# EAGLE design RasPi-BplusHAT (EAGLE 7.3.0)
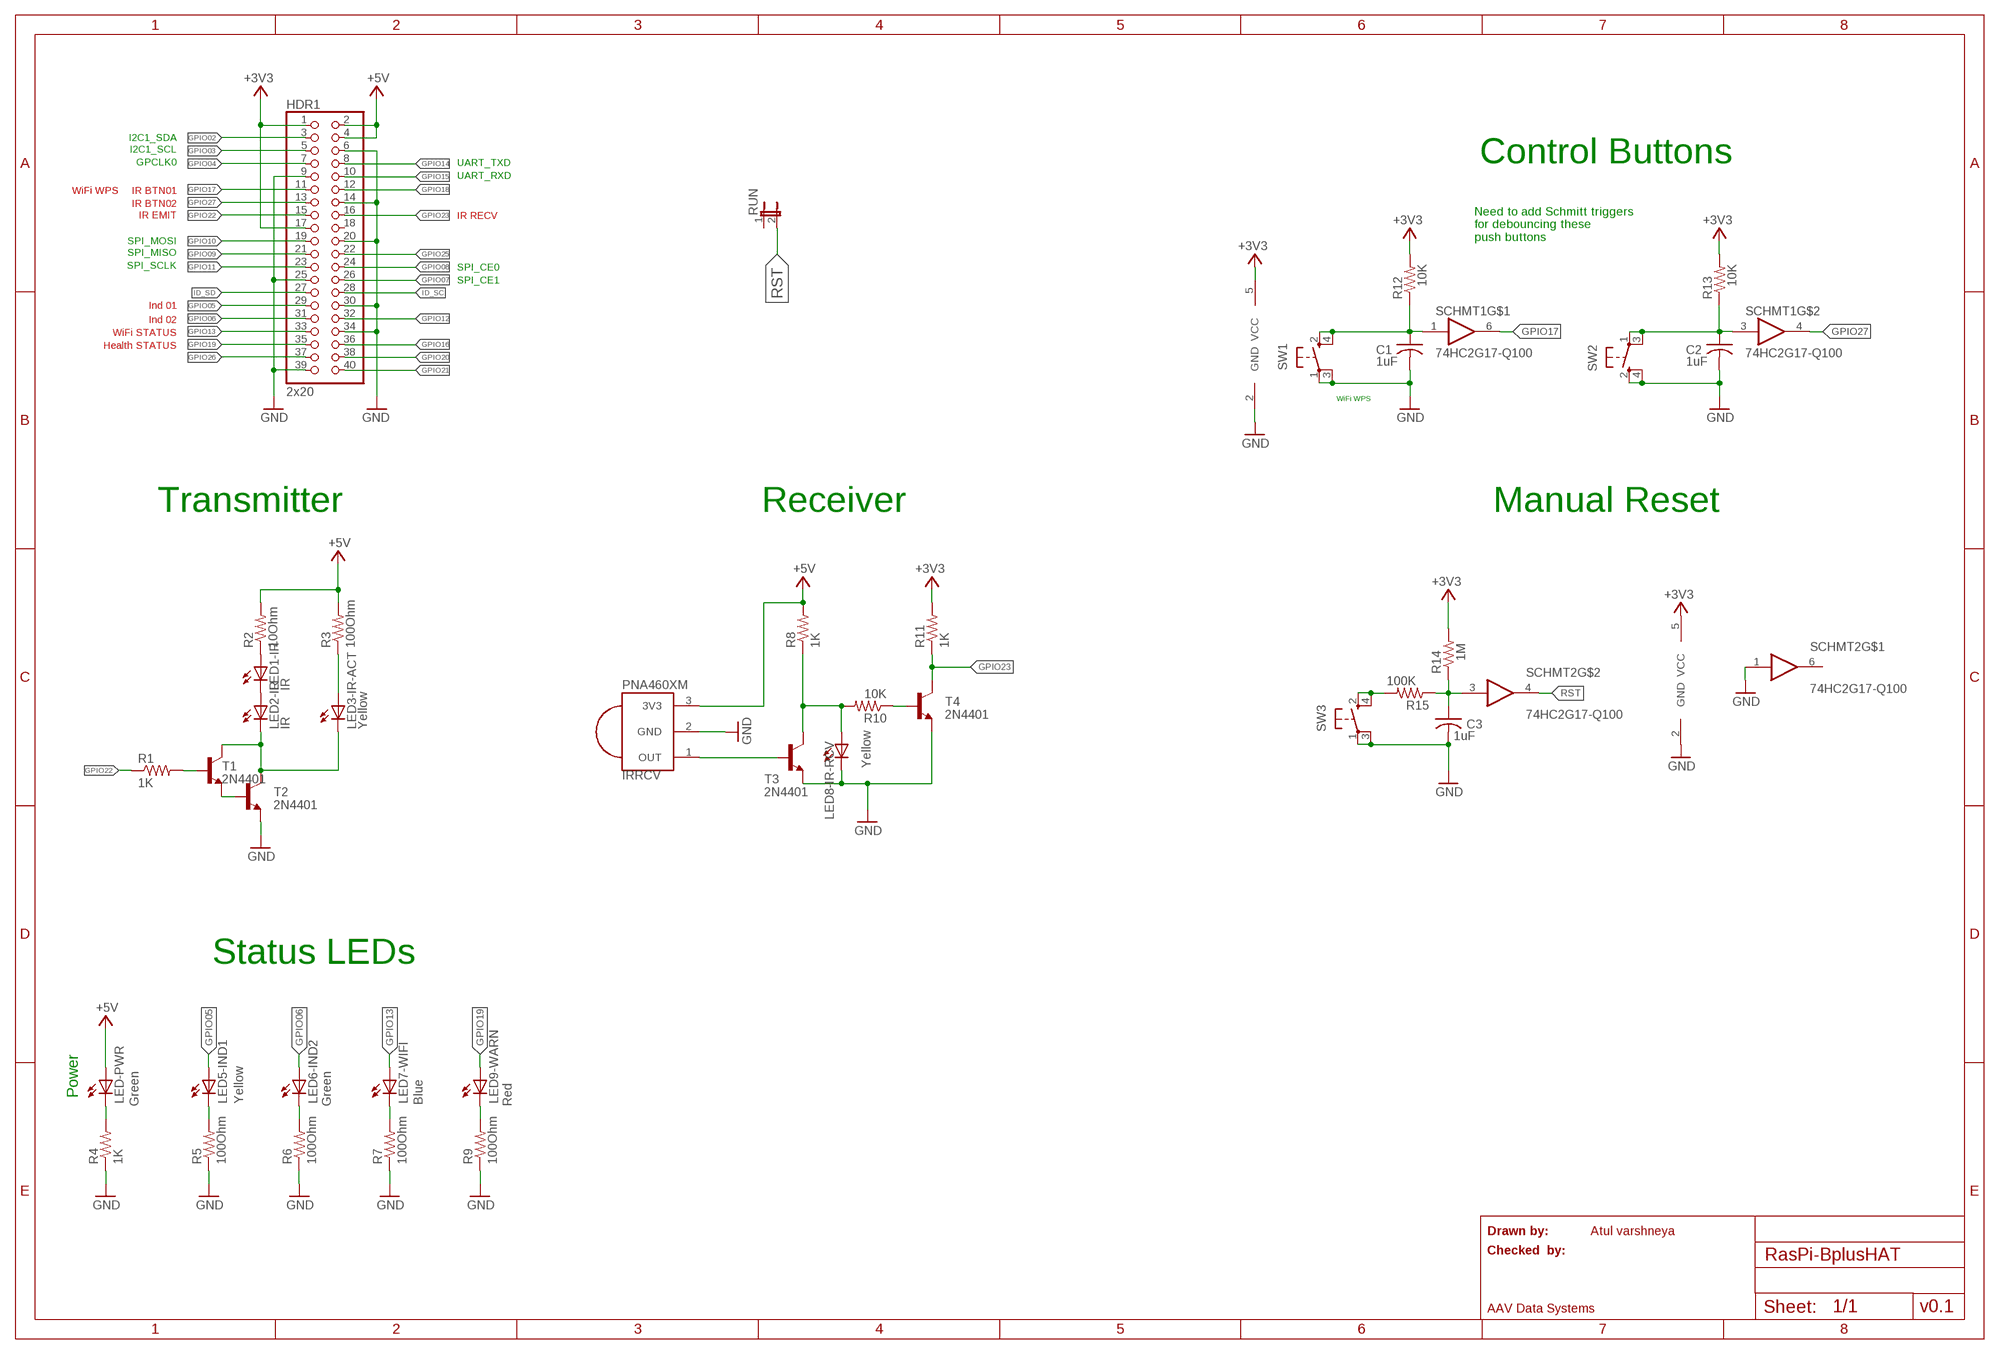
[diagram p0: schematic, sheet 1]

## Parts
C1  1uF  C-USC0805  [C0805]
C2  1uF  C-USC0805  [C0805]
C3  1uF  C-USC0805  [C0805]
HDR1  2x20  PINHD-2X20  [2X20]
IRRCV  PNA460XM  [PNA460XM]
LED1-IR  IR  LEDMICRO-SIDELED  [MICRO-SIDELED]
LED2-IR  IR  LEDMICRO-SIDELED  [MICRO-SIDELED]
LED3-IR-ACT  Yellow  LEDCHIPLED_0805  [CHIPLED_0805]
LED5-IND1  Yellow  LEDCHIPLED_0805  [CHIPLED_0805]
LED6-IND2  Green  LEDCHIPLED_0805  [CHIPLED_0805]
LED7-WIFI  Blue  LEDCHIPLED_0805  [CHIPLED_0805]
LED8-IR-RCV  Yellow  LEDCHIPLED_0805  [CHIPLED_0805]
LED9-WARN  Red  LEDCHIPLED_0805  [CHIPLED_0805]
LED-PWR  Green  LEDCHIPLED_0805  [CHIPLED_0805]
R1  1K  R-US_R0805  [R0805]
R2  10Ohm  R-US_R0805  [R0805]
R3  100Ohm  R-US_R0805  [R0805]
R4  1K  R-US_R0805  [R0805]
R5  100Ohm  R-US_R0805  [R0805]
R6  100Ohm  R-US_R0805  [R0805]
R7  100Ohm  R-US_R0805  [R0805]
R8  1K  R-US_R0805  [R0805]
R9  100Ohm  R-US_R0805  [R0805]
R10  10K  R-US_R0805  [R0805]
R11  1K  R-US_R0805  [R0805]
R12  10K  R-US_R0805  [R0805]
R13  10K  R-US_R0805  [R0805]
R14  1M  R-US_R0805  [R0805]
R15  100K  R-US_R0805  [R0805]
RUN  RST  JP1E  [JP1]
SCHMT1  74HC2G17-Q100  [SC-70-6L]
SCHMT2  74HC2G17-Q100  [SC-70-6L]
SW1  SPST_TACT-KMR2  [KMR2]
SW2  SPST_TACT-KMR2  [KMR2]
SW3  SPST_TACT-KMR2  [KMR2]
T1  2N4401  MMBT4401LT1-NPN-SOT23-BEC  [SOT23-BEC]
T2  2N4401  MMBT4401LT1-NPN-SOT23-BEC  [SOT23-BEC]
T3  2N4401  MMBT4401LT1-NPN-SOT23-BEC  [SOT23-BEC]
T4  2N4401  MMBT4401LT1-NPN-SOT23-BEC  [SOT23-BEC]

## Nets
+3V3: HDR1.1 HDR1.17 R11.2 R12.2 R13.2 R14.2 SCHMT1.5(VCC) SCHMT2.5(VCC)
+5V: HDR1.2 HDR1.4 IRRCV.3(3V3) LED-PWR.A R2.2 R3.2 R8.2
GND: C1.2 C2.2 C3.2 HDR1.6 HDR1.9 HDR1.14 HDR1.20 HDR1.25 HDR1.30 HDR1.34 HDR1.39 IRRCV.2(GND) LED8-IR-RCV.C R4.1 R5.1 R6.1 R7.1 R9.1 SCHMT1.2(GND) SCHMT2.1(I) SCHMT2.2(GND) SW1.1(P) SW1.3(P1) SW2.2(S) SW2.4(S1) SW3.1(P) SW3.3(P1) T2.E T3.E T4.E
GPIO02: HDR1.3
GPIO03: HDR1.5
GPIO04: HDR1.7
GPIO05: HDR1.29 LED5-IND1.A
GPIO06: HDR1.31 LED6-IND2.A
GPIO07: HDR1.26
GPIO08: HDR1.24
GPIO09: HDR1.21
GPIO10: HDR1.19
GPIO11: HDR1.23
GPIO12: HDR1.32
GPIO13: HDR1.33 LED7-WIFI.A
GPIO14: HDR1.8
GPIO15: HDR1.10
GPIO16: HDR1.36
GPIO17: HDR1.11 SCHMT1.6(O)
GPIO18: HDR1.12
GPIO19: HDR1.35 LED9-WARN.A
GPIO20: HDR1.38
GPIO21: HDR1.40
GPIO22: HDR1.15 R1.1
GPIO23: HDR1.16 R11.1 T4.C
GPIO25: HDR1.22
GPIO26: HDR1.37
GPIO27: HDR1.13 SCHMT1.4(O)
ID_SC: HDR1.28
ID_SD: HDR1.27
N$1: R15.2 SW3.2(S) SW3.4(S1)
N$2: LED1-IR.A R2.1
N$3: LED1-IR.C LED2-IR.A
N$4: LED2-IR.C LED3-IR-ACT.C T1.C T2.C
N$5: R1.2 T1.B
N$6: LED3-IR-ACT.A R3.1
N$7: LED5-IND1.C R5.2
N$8: IRRCV.1(OUT) T3.B
N$9: C1.1 R12.1 SCHMT1.1(I) SW1.2(S) SW1.4(S1)
N$10: LED8-IR-RCV.A R8.1 R10.2 T3.C
N$11: T1.E T2.B
N$12: C2.1 R13.1 SCHMT1.3(I) SW2.1(P) SW2.3(P1)
N$13: C3.1 R14.1 R15.1 SCHMT2.3(I)
N$14: LED7-WIFI.C R7.2
N$16: LED9-WARN.C R9.2
N$17: LED6-IND2.C R6.2
N$21: LED-PWR.C R4.2
N$23: R10.1 T4.B
RST: RUN.2 SCHMT2.4(O)
Unconnected: HDR1.18 RUN.1 SCHMT2.6(O)

## Notes on the sheet
- I2C1_SDA
- Control Buttons
- I2C1_SCL
- GPCLK0
- UART_TXD
- UART_RXD
- WiFi WPS | IR BTN01
- IR BTN02
- IR EMIT
- IR RECV
- SPI_MOSI
- Need to add Schmitt triggers 
  for debouncing these 
  push buttons
- SPI_MISO
- SPI_SCLK
- SPI_CE0
- SPI_CE1
- Ind 01
- Ind 02
- WiFi STATUS
- Health STATUS
- WiFi WPS
- Receiver | Manual Reset
- Transmitter
- Status LEDs
- Power
- Drawn by: | Atul varshneya
- Checked  by:
- AAV Data Systems | v0.1

## Library data of the parts
C1-C3 = adafruit:C-US: CAPACITOR, American symbol; MPN: MC0805B104K160CT; OC_NEWARK: 06R3738
HDR1 = adafruit:PINHD-2X20: PIN HEADER; OC_NEWARK: unknown
IRRCV = adafruit:PNA460XM: IR 38KHz receiver PNA4602 and related receivers http://www.ladyada.net/library/pcb/eaglelibrary.html; MPN: TSOP38238; OC_NEWARK: 02P9885
LED1-IR LED2-IR = led:LED: LED OSRAM: - CHIPLED LG R971, LG N971, LY N971, LG Q971, LY Q971, LO R971, LY R971 LH N974, LH R974 LS Q976, LO Q976, LY Q976 LO Q996 - Hyper CHIPLED LW Q18S LB Q993, LB Q99A, LB R99A - SideLED LS A670, LO A670, LY A670, LG A670, LP A670 LB A673, LV A673, LT A673, LW A673 LH A674 LY A675 LS A676, LA A676, LO A676, LY A676, LW A676 LS A679, LY A679, LG A679 - Hyper Micro SIDELED® LS Y876, LA Y876, LO Y876, LY Y876 LT Y87S - SmartLED LW L88C, LW L88S LB L89C, LB L89S, LG L890 LS L89K, LO L89K, LY L89K LS L896, LA L896, LO L896, LY L896 - TOPLED LS T670, LO T670, LY T670, LG T670, LP T670 LSG T670, LSP T670, LSY T670, LOP T670, LYG T670 LG T671, LOG T671, LSG T671 LB T673, LV T673, LT T673, LW T673 LH T674 LS T676, LA T676, LO T676, LY T676, LB T676, LH T676, LSB T676, LW T676 LB T67C, LV T67C, LT T67C, LS T67K, LO T67K, LY T67K, LW E67C LS E67B, LA E67B, LO E67B, LY E67B, LB E67C, LV E67C, LT E67C LW T67C LS T679, LY T679, LG T679 LS T770, LO T770, LY T770, LG T770, LP T770 LB T773, LV T773, LT T773, LW T773 LH T774 LS E675, LA E675, LY E675, LS T675 LS T776, LA T776, LO T776, LY T776, LB T776 LHGB T686 LT T68C, LB T68C - Hyper Mini TOPLED® LB M676 - Mini TOPLED Santana® LG M470 LS M47K, LO M47K, LY M47K Source: http://www.osram.convergy.de LUXEON: - LUMILED® LXK2-PW12-R00, LXK2-PW12-S00, LXK2-PW14-U00, LXK2-PW14-V00 LXK2-PM12-R00, LXK2-PM12-S00, LXK2-PM14-U00 LXK2-PE12-Q00, LXK2-PE12-R00, LXK2-PE12-S00, LXK2-PE14-T00, LXK2-PE14-U00 LXK2-PB12-K00, LXK2-PB12-L00, LXK2-PB12-M00, LXK2-PB14-N00, LXK2-PB14-P00, LXK2-PB14-Q00 LXK2-PR12-L00, LXK2-PR12-M00, LXK2-PR14-Q00, LXK2-PR14-R00 LXK2-PD12-Q00, LXK2-PD12-R00, LXK2-PD12-S00 LXK2-PH12-R00, LXK2-PH12-S00 LXK2-PL12-P00, LXK2-PL12-Q00, LXK2-PL12-R00 Source: www.luxeon.com KINGBRIGHT: KA-3528ASYC Source: www.kingbright.com; MPN: VSMB2943SLX01; OC_NEWARK: 62W1340
LED3-IR-ACT LED5-IND1 LED8-IR-RCV = led:LED: LED OSRAM: - CHIPLED LG R971, LG N971, LY N971, LG Q971, LY Q971, LO R971, LY R971 LH N974, LH R974 LS Q976, LO Q976, LY Q976 LO Q996 - Hyper CHIPLED LW Q18S LB Q993, LB Q99A, LB R99A - SideLED LS A670, LO A670, LY A670, LG A670, LP A670 LB A673, LV A673, LT A673, LW A673 LH A674 LY A675 LS A676, LA A676, LO A676, LY A676, LW A676 LS A679, LY A679, LG A679 - Hyper Micro SIDELED® LS Y876, LA Y876, LO Y876, LY Y876 LT Y87S - SmartLED LW L88C, LW L88S LB L89C, LB L89S, LG L890 LS L89K, LO L89K, LY L89K LS L896, LA L896, LO L896, LY L896 - TOPLED LS T670, LO T670, LY T670, LG T670, LP T670 LSG T670, LSP T670, LSY T670, LOP T670, LYG T670 LG T671, LOG T671, LSG T671 LB T673, LV T673, LT T673, LW T673 LH T674 LS T676, LA T676, LO T676, LY T676, LB T676, LH T676, LSB T676, LW T676 LB T67C, LV T67C, LT T67C, LS T67K, LO T67K, LY T67K, LW E67C LS E67B, LA E67B, LO E67B, LY E67B, LB E67C, LV E67C, LT E67C LW T67C LS T679, LY T679, LG T679 LS T770, LO T770, LY T770, LG T770, LP T770 LB T773, LV T773, LT T773, LW T773 LH T774 LS E675, LA E675, LY E675, LS T675 LS T776, LA T776, LO T776, LY T776, LB T776 LHGB T686 LT T68C, LB T68C - Hyper Mini TOPLED® LB M676 - Mini TOPLED Santana® LG M470 LS M47K, LO M47K, LY M47K Source: http://www.osram.convergy.de LUXEON: - LUMILED® LXK2-PW12-R00, LXK2-PW12-S00, LXK2-PW14-U00, LXK2-PW14-V00 LXK2-PM12-R00, LXK2-PM12-S00, LXK2-PM14-U00 LXK2-PE12-Q00, LXK2-PE12-R00, LXK2-PE12-S00, LXK2-PE14-T00, LXK2-PE14-U00 LXK2-PB12-K00, LXK2-PB12-L00, LXK2-PB12-M00, LXK2-PB14-N00, LXK2-PB14-P00, LXK2-PB14-Q00 LXK2-PR12-L00, LXK2-PR12-M00, LXK2-PR14-Q00, LXK2-PR14-R00 LXK2-PD12-Q00, LXK2-PD12-R00, LXK2-PD12-S00 LXK2-PH12-R00, LXK2-PH12-S00 LXK2-PL12-P00, LXK2-PL12-Q00, LXK2-PL12-R00 Source: www.luxeon.com KINGBRIGHT: KA-3528ASYC Source: www.kingbright.com; MPN: 150080YS75000; OC_NEWARK: 95W3804
LED6-IND2 LED-PWR = led:LED: LED OSRAM: - CHIPLED LG R971, LG N971, LY N971, LG Q971, LY Q971, LO R971, LY R971 LH N974, LH R974 LS Q976, LO Q976, LY Q976 LO Q996 - Hyper CHIPLED LW Q18S LB Q993, LB Q99A, LB R99A - SideLED LS A670, LO A670, LY A670, LG A670, LP A670 LB A673, LV A673, LT A673, LW A673 LH A674 LY A675 LS A676, LA A676, LO A676, LY A676, LW A676 LS A679, LY A679, LG A679 - Hyper Micro SIDELED® LS Y876, LA Y876, LO Y876, LY Y876 LT Y87S - SmartLED LW L88C, LW L88S LB L89C, LB L89S, LG L890 LS L89K, LO L89K, LY L89K LS L896, LA L896, LO L896, LY L896 - TOPLED LS T670, LO T670, LY T670, LG T670, LP T670 LSG T670, LSP T670, LSY T670, LOP T670, LYG T670 LG T671, LOG T671, LSG T671 LB T673, LV T673, LT T673, LW T673 LH T674 LS T676, LA T676, LO T676, LY T676, LB T676, LH T676, LSB T676, LW T676 LB T67C, LV T67C, LT T67C, LS T67K, LO T67K, LY T67K, LW E67C LS E67B, LA E67B, LO E67B, LY E67B, LB E67C, LV E67C, LT E67C LW T67C LS T679, LY T679, LG T679 LS T770, LO T770, LY T770, LG T770, LP T770 LB T773, LV T773, LT T773, LW T773 LH T774 LS E675, LA E675, LY E675, LS T675 LS T776, LA T776, LO T776, LY T776, LB T776 LHGB T686 LT T68C, LB T68C - Hyper Mini TOPLED® LB M676 - Mini TOPLED Santana® LG M470 LS M47K, LO M47K, LY M47K Source: http://www.osram.convergy.de LUXEON: - LUMILED® LXK2-PW12-R00, LXK2-PW12-S00, LXK2-PW14-U00, LXK2-PW14-V00 LXK2-PM12-R00, LXK2-PM12-S00, LXK2-PM14-U00 LXK2-PE12-Q00, LXK2-PE12-R00, LXK2-PE12-S00, LXK2-PE14-T00, LXK2-PE14-U00 LXK2-PB12-K00, LXK2-PB12-L00, LXK2-PB12-M00, LXK2-PB14-N00, LXK2-PB14-P00, LXK2-PB14-Q00 LXK2-PR12-L00, LXK2-PR12-M00, LXK2-PR14-Q00, LXK2-PR14-R00 LXK2-PD12-Q00, LXK2-PD12-R00, LXK2-PD12-S00 LXK2-PH12-R00, LXK2-PH12-S00 LXK2-PL12-P00, LXK2-PL12-Q00, LXK2-PL12-R00 Source: www.luxeon.com KINGBRIGHT: KA-3528ASYC Source: www.kingbright.com; MPN: 150080GS75000; OC_NEWARK: 95W3800
LED7-WIFI = led:LED: LED OSRAM: - CHIPLED LG R971, LG N971, LY N971, LG Q971, LY Q971, LO R971, LY R971 LH N974, LH R974 LS Q976, LO Q976, LY Q976 LO Q996 - Hyper CHIPLED LW Q18S LB Q993, LB Q99A, LB R99A - SideLED LS A670, LO A670, LY A670, LG A670, LP A670 LB A673, LV A673, LT A673, LW A673 LH A674 LY A675 LS A676, LA A676, LO A676, LY A676, LW A676 LS A679, LY A679, LG A679 - Hyper Micro SIDELED® LS Y876, LA Y876, LO Y876, LY Y876 LT Y87S - SmartLED LW L88C, LW L88S LB L89C, LB L89S, LG L890 LS L89K, LO L89K, LY L89K LS L896, LA L896, LO L896, LY L896 - TOPLED LS T670, LO T670, LY T670, LG T670, LP T670 LSG T670, LSP T670, LSY T670, LOP T670, LYG T670 LG T671, LOG T671, LSG T671 LB T673, LV T673, LT T673, LW T673 LH T674 LS T676, LA T676, LO T676, LY T676, LB T676, LH T676, LSB T676, LW T676 LB T67C, LV T67C, LT T67C, LS T67K, LO T67K, LY T67K, LW E67C LS E67B, LA E67B, LO E67B, LY E67B, LB E67C, LV E67C, LT E67C LW T67C LS T679, LY T679, LG T679 LS T770, LO T770, LY T770, LG T770, LP T770 LB T773, LV T773, LT T773, LW T773 LH T774 LS E675, LA E675, LY E675, LS T675 LS T776, LA T776, LO T776, LY T776, LB T776 LHGB T686 LT T68C, LB T68C - Hyper Mini TOPLED® LB M676 - Mini TOPLED Santana® LG M470 LS M47K, LO M47K, LY M47K Source: http://www.osram.convergy.de LUXEON: - LUMILED® LXK2-PW12-R00, LXK2-PW12-S00, LXK2-PW14-U00, LXK2-PW14-V00 LXK2-PM12-R00, LXK2-PM12-S00, LXK2-PM14-U00 LXK2-PE12-Q00, LXK2-PE12-R00, LXK2-PE12-S00, LXK2-PE14-T00, LXK2-PE14-U00 LXK2-PB12-K00, LXK2-PB12-L00, LXK2-PB12-M00, LXK2-PB14-N00, LXK2-PB14-P00, LXK2-PB14-Q00 LXK2-PR12-L00, LXK2-PR12-M00, LXK2-PR14-Q00, LXK2-PR14-R00 LXK2-PD12-Q00, LXK2-PD12-R00, LXK2-PD12-S00 LXK2-PH12-R00, LXK2-PH12-S00 LXK2-PL12-P00, LXK2-PL12-Q00, LXK2-PL12-R00 Source: www.luxeon.com KINGBRIGHT: KA-3528ASYC Source: www.kingbright.com; MPN: 150080BS75000; OC_NEWARK: 95W3799
LED9-WARN = led:LED: LED OSRAM: - CHIPLED LG R971, LG N971, LY N971, LG Q971, LY Q971, LO R971, LY R971 LH N974, LH R974 LS Q976, LO Q976, LY Q976 LO Q996 - Hyper CHIPLED LW Q18S LB Q993, LB Q99A, LB R99A - SideLED LS A670, LO A670, LY A670, LG A670, LP A670 LB A673, LV A673, LT A673, LW A673 LH A674 LY A675 LS A676, LA A676, LO A676, LY A676, LW A676 LS A679, LY A679, LG A679 - Hyper Micro SIDELED® LS Y876, LA Y876, LO Y876, LY Y876 LT Y87S - SmartLED LW L88C, LW L88S LB L89C, LB L89S, LG L890 LS L89K, LO L89K, LY L89K LS L896, LA L896, LO L896, LY L896 - TOPLED LS T670, LO T670, LY T670, LG T670, LP T670 LSG T670, LSP T670, LSY T670, LOP T670, LYG T670 LG T671, LOG T671, LSG T671 LB T673, LV T673, LT T673, LW T673 LH T674 LS T676, LA T676, LO T676, LY T676, LB T676, LH T676, LSB T676, LW T676 LB T67C, LV T67C, LT T67C, LS T67K, LO T67K, LY T67K, LW E67C LS E67B, LA E67B, LO E67B, LY E67B, LB E67C, LV E67C, LT E67C LW T67C LS T679, LY T679, LG T679 LS T770, LO T770, LY T770, LG T770, LP T770 LB T773, LV T773, LT T773, LW T773 LH T774 LS E675, LA E675, LY E675, LS T675 LS T776, LA T776, LO T776, LY T776, LB T776 LHGB T686 LT T68C, LB T68C - Hyper Mini TOPLED® LB M676 - Mini TOPLED Santana® LG M470 LS M47K, LO M47K, LY M47K Source: http://www.osram.convergy.de LUXEON: - LUMILED® LXK2-PW12-R00, LXK2-PW12-S00, LXK2-PW14-U00, LXK2-PW14-V00 LXK2-PM12-R00, LXK2-PM12-S00, LXK2-PM14-U00 LXK2-PE12-Q00, LXK2-PE12-R00, LXK2-PE12-S00, LXK2-PE14-T00, LXK2-PE14-U00 LXK2-PB12-K00, LXK2-PB12-L00, LXK2-PB12-M00, LXK2-PB14-N00, LXK2-PB14-P00, LXK2-PB14-Q00 LXK2-PR12-L00, LXK2-PR12-M00, LXK2-PR14-Q00, LXK2-PR14-R00 LXK2-PD12-Q00, LXK2-PD12-R00, LXK2-PD12-S00 LXK2-PH12-R00, LXK2-PH12-S00 LXK2-PL12-P00, LXK2-PL12-Q00, LXK2-PL12-R00 Source: www.luxeon.com KINGBRIGHT: KA-3528ASYC Source: www.kingbright.com; MPN: 150080RS75000; OC_NEWARK: 95W3801
R1 R4 R8 R11 = adafruit:R-US_: RESISTOR, American symbol; MF: VISHAY/DALE; MPN: CRCW08051K00FKEA; OC_NEWARK: 52K9723
R2 = adafruit:R-US_: RESISTOR, American symbol; MF: VISHAY/DALE; MPN: CRCW080510R0FKEA; OC_NEWARK: 52K9804
R3 R5-R7 R9 = adafruit:R-US_: RESISTOR, American symbol; MF: VISHAY/DALE; MPN: CRCW0805100RFKEA; OC_NEWARK: 52K9809
R10 R12 R13 = adafruit:R-US_: RESISTOR, American symbol; MF: VISHAY/DALE; MPN: CRCW080510K0FKEA; OC_NEWARK: 52K9795
R14 = adafruit:R-US_: RESISTOR, American symbol; MF: VISHAY/DALE; MPN: CRCW08051M00FKEA; OC_NEWARK: 52K9759
R15 = adafruit:R-US_: RESISTOR, American symbol; MF: VISHAY/DALE; MPN: CRCW0805100KFKEA; OC_NEWARK: 52K9808
RUN = jumper:JP1E: JUMPER; MPN: 2211S-02G; OC_NEWARK: 08N6744
SCHMT1 SCHMT2 = varshneya:74HC2G17-Q100: Dual schmitt non-inverting buffer; MPN: 74HC2G17GW,125; OC_NEWARK: 71R2196
SW1-SW3 = adafruit:SPST_TACT: SMT 6mm switch, EVQQ2 series http://www.ladyada.net/library/eagle; OC_NEWARK: unknown
T1 T2 = transistor-neu-to92:*-NPN-: NPN Transistror BF959 corrected 2008.03.06; MPN: MMBT4401-TP; OC_NEWARK: 51T4931
T3 T4 = transistor:*-NPN-: NPN Transistror BF959 corrected 2008.03.06; MPN: MMBT4401-TP; OC_NEWARK: 51T4931

## Board
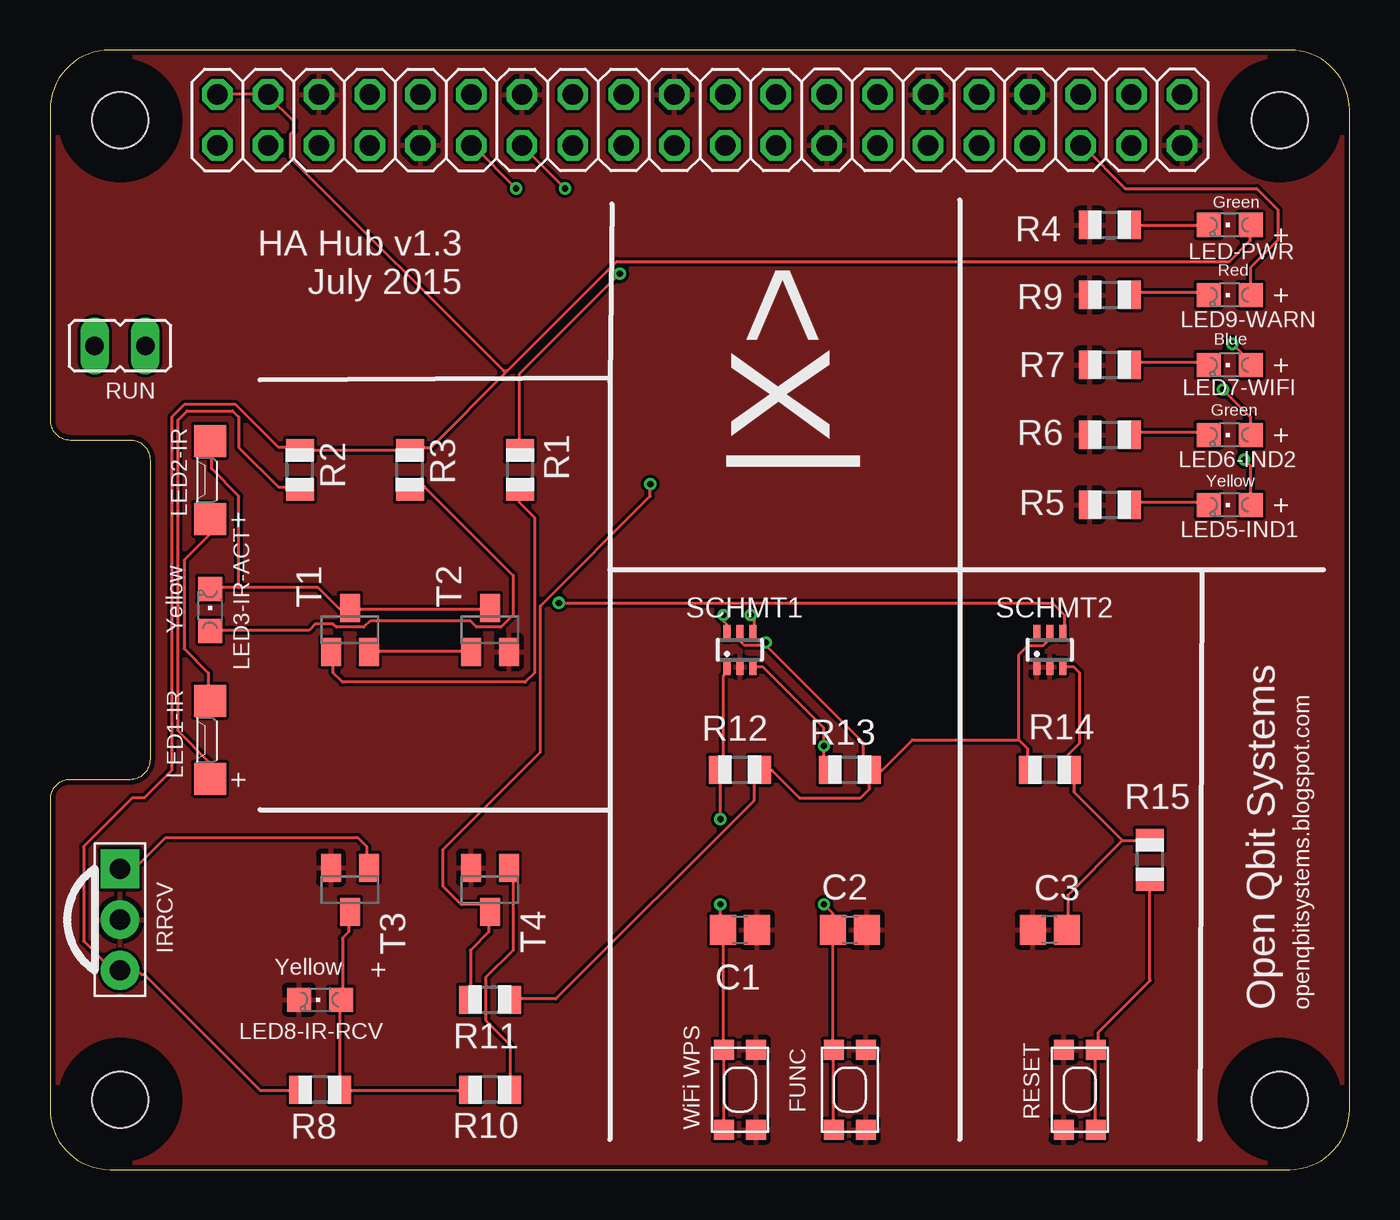
[diagram p1: board, top side]
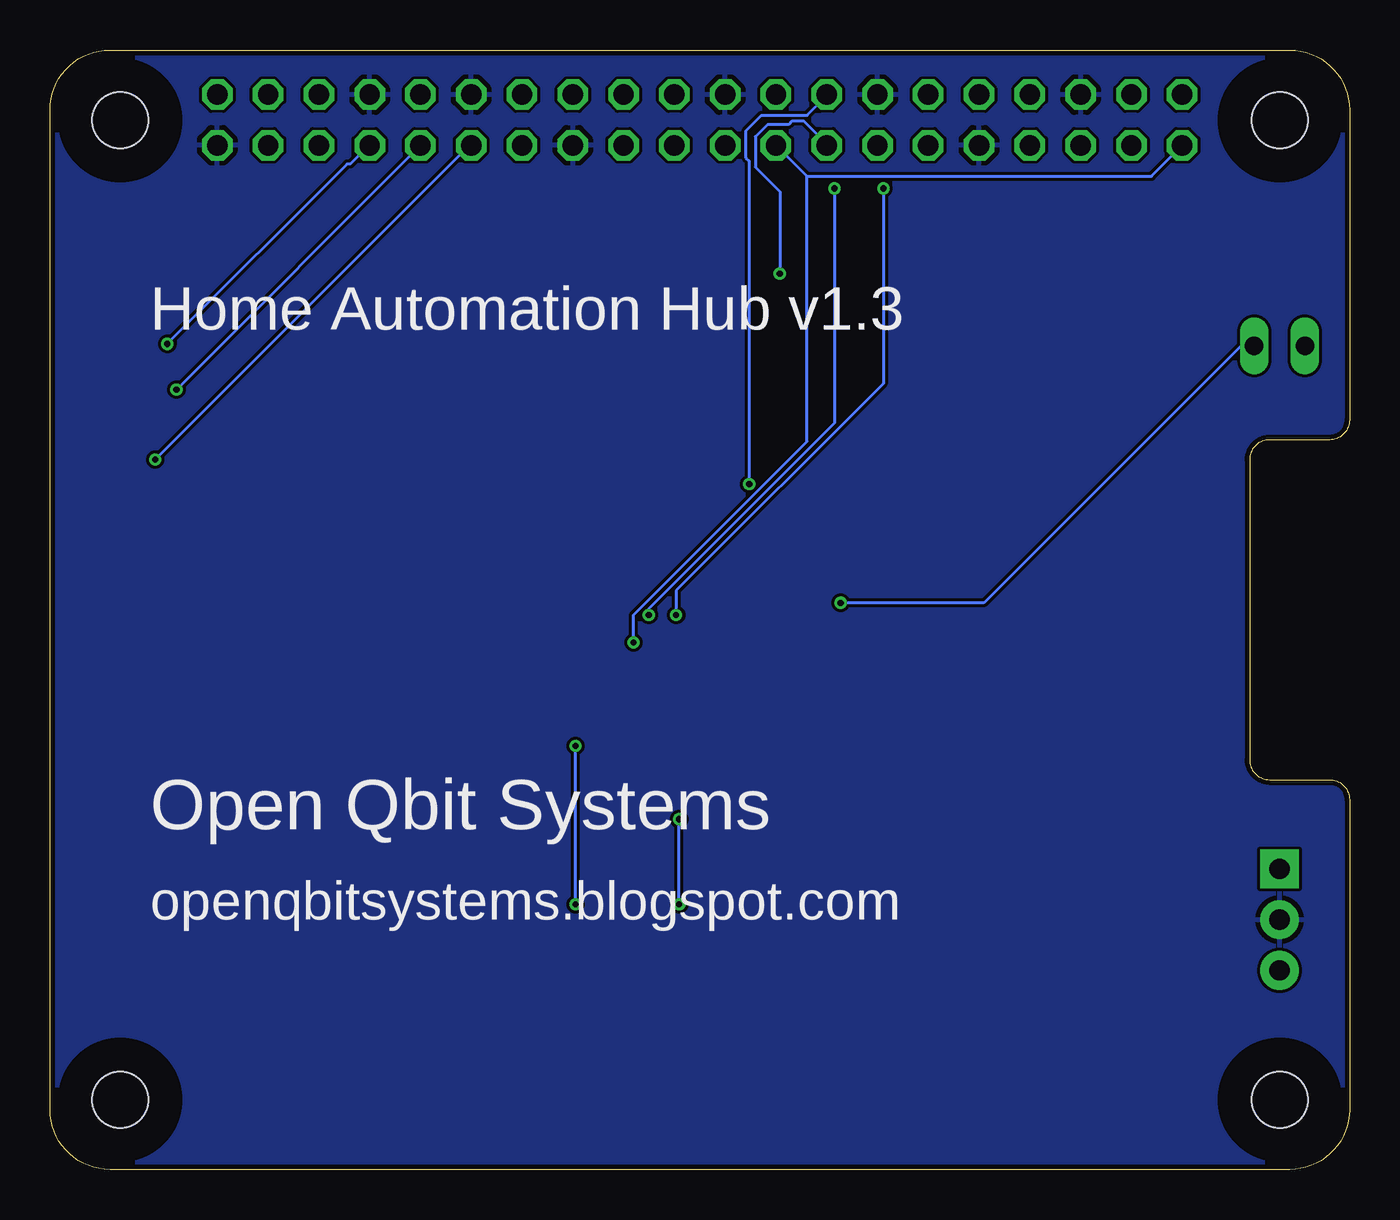
[diagram p2: board, bottom side, seen from below]

Size 65 x 56 mm. Coordinates in mm from the lower left corner, seen from the top.
Outline: 0,3 arc90 3,0 62,0 arc90 65,3 65,53 arc90 62,56 3,56 arc90 0,53 0,37.5 arc90 1,36.5 4,36.5 arc-90 5,35.5 5,20.5 arc-90 4,19.5 1,19.5 arc90 0,18.5 0,3
Copper layers (1*16): Top 0.035mm / dielectric 1.5mm / Bottom 0.035mm
Design rules "ITEADstudio_DRC": minimum track width 6mil, minimum drill 12mil, track to track 6mil, track to pad 6mil, pad to pad 6mil, via to via 6mil, smd to smd 0mil, copper to edge 10mil, drill to drill 10mil, minimum pad ring 10mil, minimum via ring 6mil, stop-mask expansion 2mil, vias tented up to drill 100mil, thermal gap 10mil
Holes 2.8 mm at 3.5,3.5 3.5,52.5 61.5,52.5 61.5,3.5
tRestrict: area 1.9,51 to 5,54; area 60,51 to 63,54; area 60,1.9 to 63,5; area 1.9,1.9 to 5,5
bRestrict: area 1.9,1.9 to 5,5; area 1.9,51 to 5,54; area 60,1.9 to 63,5; area 60,51 to 63,54

### Footprints (pad centres in the part's own frame; a part is rotated, then mirrored left to right if it is on the bottom)
C0805 = smd 1.3 x 1.5: 1 -0.85,0; 2 0.85,0
2X20 = drill 1.016 octagon: 1 -24.13,-1.27; 2 -24.13,1.27; 3 -21.59,-1.27; 4 -21.59,1.27; 5 -19.05,-1.27; 6 -19.05,1.27; 7 -16.51,-1.27; 8 -16.51,1.27; 9 -13.97,-1.27; 10 -13.97,1.27; 11 -11.43,-1.27; 12 -11.43,1.27; 13 -8.89,-1.27; 14 -8.89,1.27; 15 -6.35,-1.27; 16 -6.35,1.27; 17 -3.81,-1.27; 18 -3.81,1.27; 19 -1.27,-1.27; 20 -1.27,1.27; 21 1.27,-1.27; 22 1.27,1.27; 23 3.81,-1.27; 24 3.81,1.27; 25 6.35,-1.27; 26 6.35,1.27; 27 8.89,-1.27; 28 8.89,1.27; 29 11.43,-1.27; 30 11.43,1.27; 31 13.97,-1.27; 32 13.97,1.27; 33 16.51,-1.27; 34 16.51,1.27; 35 19.05,-1.27; 36 19.05,1.27; 37 21.59,-1.27; 38 21.59,1.27; 39 24.13,-1.27; 40 24.13,1.27
PNA460XM = drill 1.016 pad 1.93 square: 1 -2.54,0 | drill 1.016 pad 1.93: 2 0,0; 3 2.54,0
MICRO-SIDELED = smd 1.6 x 1.6: A 0,1.95; C 0,-1.95
CHIPLED_0805 = smd 1.2 x 1.2: A 0,-1.05; C 0,1.05
R0805 = smd 1.1 x 1.4: 1 -1,0; 2 1,0
JP1 = drill 0.914 long: 1 0,-1.27; 2 0,1.27
SC-70-6L = smd 0.35 x 0.8: 1 -0.65,-0.85; 2 0,-0.85; 3 0.65,-0.85; 4 0.65,0.85; 5 0,0.85; 6 -0.65,0.85
KMR2 = smd 1 x 1: 1 2,0.8; 2 2,-0.8; 3 -2,0.8; 4 -2,-0.8
SOT23-BEC = smd 1 x 1.4: B -0.95,-1.1; C 0,1.1; E 0.95,-1.1

### Placement (x,y rotation side)
C1  34.5,12 0 top
C2  40,12 0 top
C3  50,12 180 top
HDR1  32.5,52.5 0 top
IRRCV  3.5,12.5 270 top
LED1-IR  8,21.5 180 top
LED2-IR  8,34.5 180 top
LED3-IR-ACT  8,28 0 top
LED5-IND1  59,33.25 90 top
LED6-IND2  59,36.75 90 top
LED7-WIFI  59,40.25 90 top
LED8-IR-RCV  13.5,8.5 90 top
LED9-WARN  59,43.75 90 top
LED-PWR  59,47.25 90 top
R1  23.5,35 270 top
R2  12.5,35 90 top
R3  18,35 90 top
R4  53,47.25 0 top
R5  53,33.25 0 top
R6  53,36.75 0 top
R7  53,40.25 0 top
R8  13.5,4 180 top
R9  53,43.75 0 top
R10  22,4 180 top
R11  22,8.5 0 top
R12  34.5,20 0 top
R13  40,20 0 top
R14  50,20 180 top
R15  55,15.5 270 top
RUN  3.5,41.2 270 top
SCHMT1  34.5,26 0 top
SCHMT2  50,26 0 top
SW1  34.5,4 270 top
SW2  40,4 90 top
SW3  51.5,4 90 top
T1  15,27 0 top
T2  22,27 0 top
T3  15,14 180 top
T4  22,14 180 top

### Tracks (layer width: path | path; a pad name or v marks a point on that pad's centre or on a via)
+3V3  (via drill 0.3)
  Top 0.152: 48.46,21.49 48.46,25.76 48.92,26.21 49.68,26.21 49.99,26.52 49.99,26.82 SCHMT2.5 | 48.46,21.49 48.92,21.03 48.92,20.12 R14.2 | 35.81,26.21 34.75,26.21 34.59,26.36 34.59,26.82 SCHMT1.5 | 35.81,26.21 40.69,21.34 40.69,20.42 41,20.12 R13.2 | 48.46,21.49 43.13,21.49 41.6,19.96 41.15,19.96 R13.2 | R11.2 23.01,8.53 25.3,8.53 35.2,18.44 35.2,19.81 35.36,19.96 R12.2 35.51,19.96 36.12,19.96 37.49,18.59 40.54,18.59 41,19.05 41,19.96 R13.2 | 35.81,26.21 v35.81,26.36
  Bottom 0.152: 27.13,49.68 9.91,49.68 8.38,51.21 HDR1.1 | 27.13,49.68 28.65,51.21 HDR1.17 | 27.13,49.68 27.13,36.42 35.81,27.74 v35.81,26.36
+5V
  Top 0.152: R8.2 12.5,3.96 10.52,3.96 4.72,9.75 4.57,9.75 4.42,9.91 3.5,9.91 IRRCV.3 3.35,10.06 3.05,10.06 1.68,11.43 1.68,16.15 4.12,18.59 4.72,18.59 6.1,19.96 6.1,37.64 6.71,38.25 9.3,38.25 11.43,36.12 12.5,36.12 R2.2 12.65,35.97 17.98,35.97 R3.2 18.14,36.12 19.05,36.12 22.86,39.93 | HDR1.2 8.38,53.8 10.82,53.8 HDR1.4 10.97,53.65 12.19,52.43 12.19,51.97 12.04,51.82 12.04,50.6 22.71,39.93 22.86,39.93 | 22.86,39.93 28.35,45.41 58.98,45.41 60.05,46.48 LED-PWR.A
GND
  pour Bottom: 0,3 arc90 3,0 62,0 arc90 65,3 65,53 arc90 62,56 3,56 arc90 0,53 0,37.5 arc90 1,36.5 4,36.5 arc-90 5,35.5 5,20.5 arc-90 4,19.5 1,19.5 arc90 0,18.5
  pour Top: 0,3 arc90 3,0 62,0 arc90 65,3 65,53 arc90 62,56 3,56 arc90 0,53 0,37.5 arc90 1,36.5 4,36.5 arc-90 5,35.5 5,20.5 arc-90 4,19.5 1,19.5 arc90 0,18.5
GPIO05  (via drill 0.3)
  Top 0.152: v59.74,35.51 60.05,35.2 60.05,33.38 LED5-IND1.A
  Bottom 0.152: v59.74,35.51 44.04,51.21 HDR1.29
GPIO06  (via drill 0.3)
  Top 0.152: v58.67,39.01 60.05,37.64 60.05,36.88 LED6-IND2.A
  Bottom 0.152: v58.67,39.01 46.48,51.21 HDR1.31
GPIO13  (via drill 0.3)
  Top 0.152: v59.13,41.3 60.05,40.39 LED7-WIFI.A
  Bottom 0.152: v59.13,41.3 50.14,50.29 49.99,50.29 49.07,51.21 HDR1.33
GPIO17  (via drill 0.3)
  Top 0.152: v33.68,27.74 33.68,27.43 33.83,27.28 33.83,26.98 SCHMT1.6 | v23.32,49.07 21.18,51.21 HDR1.11
  Bottom 0.152: v33.68,27.74 33.68,28.96 23.32,39.32 v23.32,49.07
GPIO19
  Top 0.152: LED9-WARN.A 60.05,43.89 60.05,45.11 61.42,46.48 61.42,48.01 60.35,49.07 53.8,49.07 51.66,51.21 HDR1.35
GPIO22  (via drill 0.3)
  Top 0.152: v28.5,44.81 23.47,39.78 23.47,36.12 R1.1
  Bottom 0.152: v28.5,44.81 28.5,48.92 29.72,50.14 29.72,51.66 29.11,52.27 28.04,52.27 27.89,52.43 27.28,52.43 26.21,51.36 HDR1.15
GPIO23  (via drill 0.3)
  Top 0.152: R11.1 21.03,8.53 21.03,10.97 21.95,11.89 21.95,12.8 T4.C 21.95,12.95 21.64,13.26 20.57,13.26 19.66,14.17 19.66,16 24.54,20.88 24.54,28.19 30.02,33.68 v30.02,34.29
  Bottom 0.152: v30.02,34.29 30.02,50.44 30.18,50.6 30.18,51.97 29.41,52.73 27.13,52.73 26.21,53.65 HDR1.16
GPIO27  (via drill 0.3)
  Top 0.152: v35.05,27.74 35.2,27.58 35.2,26.98 SCHMT1.4 | v25.76,49.07 23.62,51.21 HDR1.13
  Bottom 0.152: v35.05,27.74 35.05,28.04 25.76,37.34 v25.76,49.07
N$1
  Top 0.152: SW3.4 52.27,2.13 52.27,5.94 SW3.2 52.43,6.1 52.43,6.86 55.02,9.45 55.02,14.48 R15.2
N$2
  Top 0.152: R2.1 12.5,34.14 11.43,34.14 9.45,36.12 9.45,37.64 9.14,37.95 6.86,37.95 6.4,37.49 6.4,21.95 7.92,20.42 7.92,19.66 LED1-IR.A
N$3
  Top 0.152: LED1-IR.C 7.92,23.47 7.92,24.84 6.71,26.06 6.71,30.48 7.92,31.7 7.92,32.46 LED2-IR.A
N$4
  Top 0.152: 9.45,29.11 13.41,29.11 14.48,28.04 14.94,28.04 T1.C 15.09,28.04 21.95,28.04 T2.C | 9.45,29.11 8.08,29.11 LED3-IR-ACT.C | 9.45,29.11 9.45,33.68 8.08,35.05 8.08,36.42 LED2-IR.C
N$5
  Top 0.152: T1.B 14.17,25.76 14.17,24.84 14.63,24.38 23.77,24.38 24.23,24.84 24.23,32.61 23.47,33.38 23.47,33.98 R1.2
N$6
  Top 0.152: LED3-IR-ACT.A 8.08,26.98 12.95,26.98 13.26,27.28 14.17,27.28 14.33,27.13 15.7,27.13 16,27.43 21.03,27.43 21.34,27.13 22.55,27.13 23.16,27.74 23.16,29.72 18.75,34.14 18.14,34.14 R3.1
N$7
  Top 0.152: LED5-IND1.C 57.91,33.38 54.1,33.38 R5.2
N$8
  Top 0.152: T3.B 15.85,15.24 15.85,16.15 15.39,16.61 5.79,16.61 4.27,15.09 3.5,15.09 IRRCV.1
N$9  (via drill 0.3)
  Top 0.152: SCHMT1.1 33.83,25.15 33.83,24.84 33.68,24.69 33.68,20.27 33.53,20.12 R12.1 33.53,19.96 v33.53,17.53 | SW1.2 33.68,2.13 33.68,5.94 SW1.4 33.68,6.1 33.68,11.89 C1.1 33.53,12.04 v33.53,13.26
  Bottom 0.152: v33.53,13.26 v33.53,17.53
N$10
  Top 0.152: T3.C 14.94,12.8 14.94,11.89 14.63,11.58 14.63,8.53 LED8-IR-RCV.A 14.48,8.38 14.48,4.12 R8.1 14.63,3.96 20.88,3.96 R10.2
N$11
  Top 0.152: T1.E 16,25.91 21.03,25.91 T2.B
N$12  (via drill 0.3)
  Top 0.152: SCHMT1.3 35.2,25.15 35.66,25.15 38.71,22.1 v38.71,21.18 38.71,20.27 38.86,20.12 R13.1 | SW2.3 39.17,2.13 39.17,5.94 SW2.1 39.17,6.1 39.17,11.89 C2.1 39.17,12.04 39.17,12.8 v38.71,13.26
  Bottom 0.152: v38.71,13.26 v38.71,21.18
N$13
  Top 0.152: SCHMT2.3 50.75,25.15 51.21,25.15 51.51,24.84 51.51,21.34 50.9,20.73 50.9,20.12 R14.1 51.05,19.96 51.21,19.81 51.21,18.9 53.65,16.46 | 53.65,16.46 54.86,16.46 R15.1 | 53.65,16.46 50.9,13.72 50.9,12.04 C3.1
N$14
  Top 0.152: LED7-WIFI.C 57.91,40.39 54.1,40.39 R7.2
N$16
  Top 0.152: LED9-WARN.C 57.91,43.89 54.1,43.89 R9.2
N$17
  Top 0.152: LED6-IND2.C 57.91,36.88 54.1,36.88 R6.2
N$21
  Top 0.152: LED-PWR.C 57.91,47.24 54.1,47.24 R4.2
N$23
  Top 0.152: R10.1 23.01,4.12 23.01,6.25 21.79,7.47 21.79,9.6 23.16,10.97 23.16,14.94 23.01,15.09 T4.B
RST  (via drill 0.3)
  Top 0.152: v25.45,28.35 50.14,28.35 50.75,27.74 50.75,26.98 SCHMT2.4
  Bottom 0.152: v25.45,28.35 18.29,28.35 5.49,41.15 4.88,41.15 RUN.2

### Text on the board
tPlace: + | + | + | + | + | + | + | +
tNames: HA Hub v1.3 / July 2015 | |X> | Open Qbit Systems | openqbitsystems.blogspot.com | FUNC | WiFi WPS | RESET
bNames: Home Automation Hub v1.3 | Open Qbit Systems | openqbitsystems.blogspot.com
Document: TODO / 1. Check the Schmitt debouncing on breadboard / 2. check the polarity of the IR LEDs / 3. Check both ICs wrt 74HC/74LV/... for 3.3V / / / DONE / 1. Add schmitt buffers for all the push buttons (create part) / 2. ELIMINATED - Verify the Watchdog circuit / 3. ELIMINATED - Will RPi gpio go in a state to allow disabling WD? / 4. Ensure long push for RESET push button (cap and resistor values) / 5. Move Power LED to the Status LEDs area / 6. check RUN location / 7. Verify the IR-RCV circuit works